# Altium project ConnectivityBoard.PrjPcb
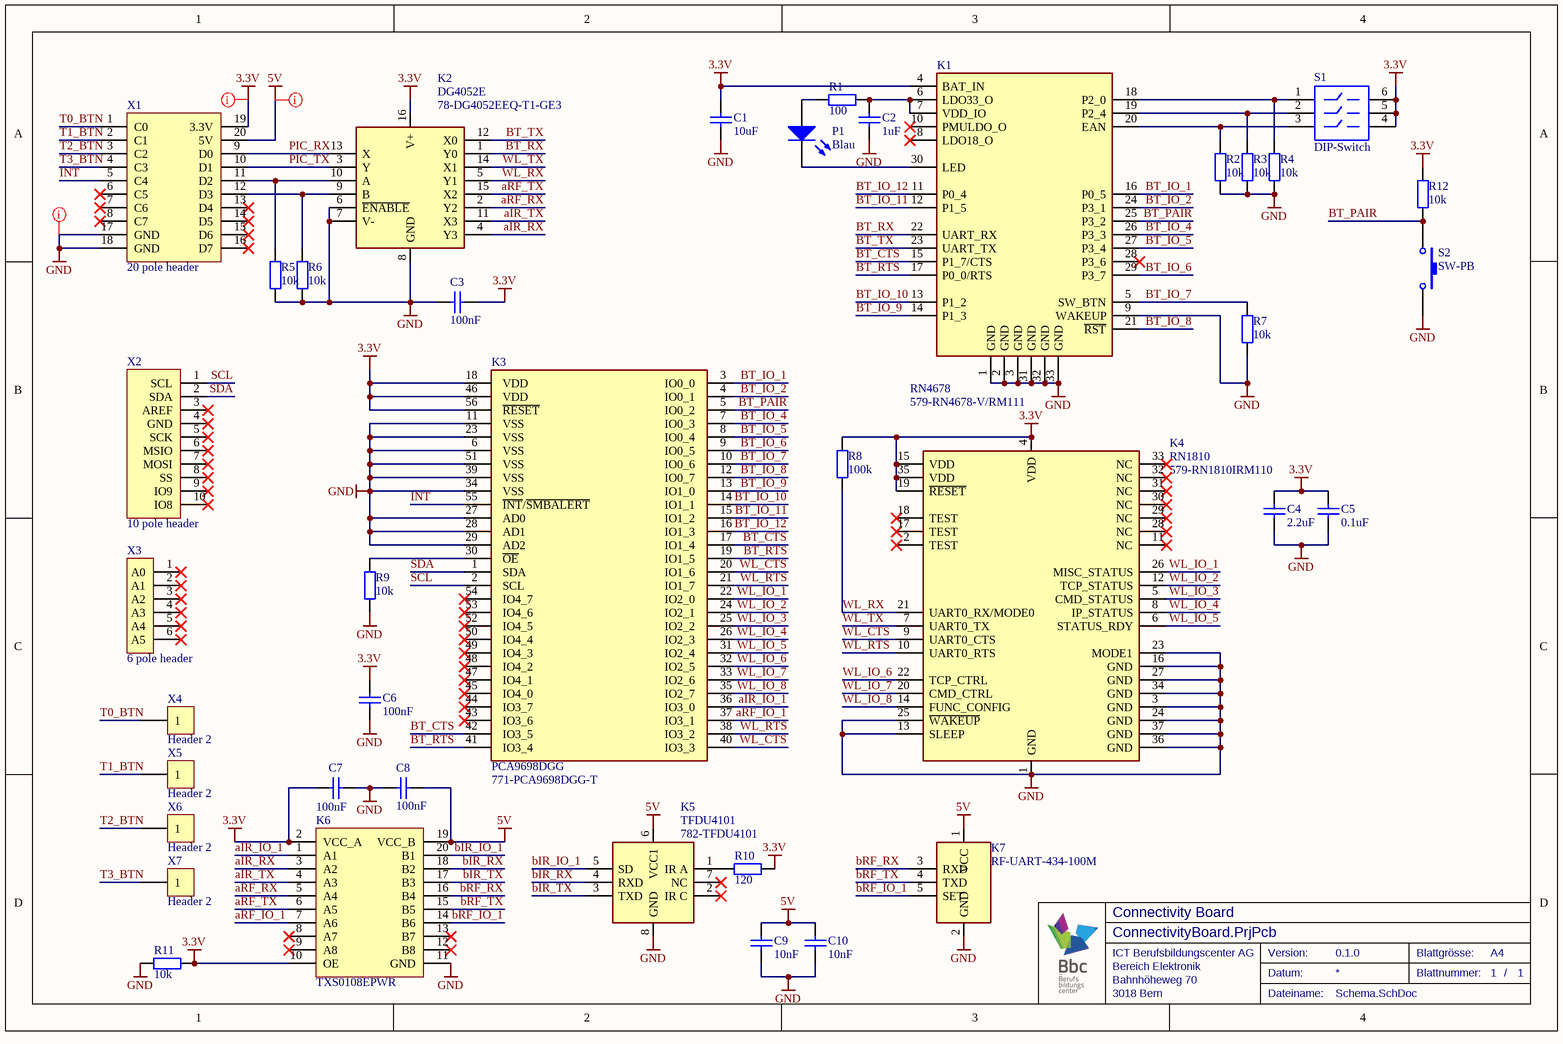
[diagram p0: Schema.SchDoc]
1 sheet, 39 parts. Net scope: global (net labels, ports and power ports of the same name join across sheets).
Board file: Leiterplatte.PcbDoc

## Sheet Schema.SchDoc: Connectivity Board
size A4; Date: 22.01.2021; Author: bweina; CompanyName: ICT Bbc AG; DrawnBy: bweina; Organization: ICT Bbc AG; DocumentNumber: 1; Revision: 0.1.0; SheetNumber: 1; SheetTotal: 1

### Parts
C1  value 10uF  [CAP CER 0805 H]  (hidden comment: Capacitor)
C2  value 1uF  [CAP CER 0805 H]  (hidden comment: Capacitor)
C3  value 100nF  [CAP CER 0805 H]  (hidden comment: Capacitor)
C4  value 2.2uF  [CAP CER 0805 H]  (hidden comment: Capacitor)
C5  value 0.1uF  [CAP CER 0805 H]  (hidden comment: Capacitor)
C6  value 100nF  [CAP CER 0805 H]  (hidden comment: Capacitor)
C7  value 100nF  [CAP CER 0805 H]  (hidden comment: Capacitor)
C8  value 100nF  [CAP CER 0805 H]  (hidden comment: Capacitor)
C9  value 10nF  [CAP CER 0805 H]  (hidden comment: Capacitor)
C10  value 10nF  [CAP CER 0805 H]  (hidden comment: Capacitor)
K1  RN4678  Supplier Part Number 1: 579-RN4678-V/RM111  [RN4678 Bluetooth Modul]
K2  DG4052E  Supplier Part Number 1: 78-DG4052EEQ-T1-GE3  [TSSOP-16]
K3  PCA9698DGG  Supplier Part Number 1: 771-PCA9698DGG-T  [TSSOP-56]
K4  RN1810  Supplier Part Number 1: 579-RN1810IRM110  [RN1810 WLAN]
K5  TFDU4101  Supplier Part Number 1: 782-TFDU4101  [TFDU4101 Infrarot Modul]
K6  TXS0108EPWR  [TSSOP-20 H]
K7  RF-UART-434-100M  [RF-UART-434-100M]
P1  Blau  [LED 1206 blue R]
R1  value 100  [RES 0805 H]  (hidden comment: Resistor)
R2  value 10k  [RES 0805 H]  (hidden comment: Resistor)
R3  value 10k  [RES 0805 H]  (hidden comment: Resistor)
R4  value 10k  [RES 0805 H]  (hidden comment: Resistor)
R5  value 10k  [RES 0805 H]  (hidden comment: Resistor)
R6  value 10k  [RES 0805 H]  (hidden comment: Resistor)
R7  value 10k  [RES 0805 H]  (hidden comment: Resistor)
R8  value 100k  [RES 0805 H]  (hidden comment: Resistor)
R9  value 10k  [RES 0805 H]  (hidden comment: Resistor)
R10  value 120  [RES 0805 H]  (hidden comment: Resistor)
R11  value 10k  [RES 0805 H]  (hidden comment: Resistor)
R12  value 10k  [RES 0805 H]  (hidden comment: Resistor)
S1  DIP-Switch  [DIP Switch SMD 3 H]
S2  SW-PB  [drucktaster]
X1  20 pole header  [Header THT male 2x10]
X2  10 pole header  [Header THT male 1x10]
X3  6 pole header  [Header THT male 1x6]
X4  Header 2  [TouchPads]
X5  Header 2  [TouchPads]
X6  Header 2  [TouchPads]
X7  Header 2  [TouchPads]

### Nets
3.3V: C1.2 C3.2 C4.2 C5.2 C6.2 C7.1 K1.4(BAT_IN) K2.16(V+) K3.18(VDD) K3.46(VDD) K3.56(~{RESET}) K4.4(VDD) K4.15(VDD) K4.19(~{RESET}) K4.35(VDD) K6.2(VCC_A) K6.10(OE) R8.2 R10.2 R11.2 R12.2 S1.4 S1.5 S1.6 X1.19(3.3V)
5V: C8.2 C9.1 C10.1 K5.6(VCC1) K6.19(VCC_B) K7.1(VCC) X1.20(5V)
GND: C1.1 C2.1 C3.1 C4.1 C5.1 C6.1 C7.2 C8.1 C9.2 C10.2 K1.1(GND) K1.2(GND) K1.3(GND) K1.9(WAKEUP) K1.31(GND) K1.32(GND) K1.33(GND) K2.6(~{ENABLE}) K2.7(V-) K2.8(GND) K3.6(VSS) K3.11(VSS) K3.23(VSS) K3.27(AD0) K3.28(AD1) K3.29(AD2) K3.34(VSS) K3.39(VSS) K3.51(VSS) K4.1(GND) K4.3(GND) K4.13(SLEEP) K4.16(GND) K4.23(MODE1) K4.24(GND) K4.25(~{WAKEUP}) K4.27(GND) K4.34(GND) K4.36(GND) K4.37(GND) K5.8(GND) K6.11(GND) K7.2(GND) R2.1 R3.1 R4.1 R5.1 R6.1 R7.1 R9.1 R11.1 S2.1 X1.17(GND) X1.18(GND)
aIR_IO_1: K3.36(IO3_0) K6.1(A1)
aIR_RX: K2.4(Y3) K6.3(A2)
aIR_TX: K2.11(X3) K6.4(A3)
aRF_IO_1: K3.37(IO3_1) K6.7(A6)
aRF_RX: K2.2(Y2) K6.5(A4)
aRF_TX: K2.15(X2) K6.6(A5)
bIR_IO_1: K5.5(SD) K6.20(B1)
bIR_RX: K5.4(RXD) K6.18(B2)
bIR_TX: K5.3(TXD) K6.17(B3)
bRF_IO_1: K6.14(B6) K7.5(SET)
bRF_RX: K6.16(B4) K7.3(RXD)
bRF_TX: K6.15(B5) K7.4(TXD)
BT_CTS: K1.15(P1_7/CTS) K3.17(IO1_4) K3.42(IO3_5)
BT_IO_1: K1.16(P0_5) K3.3(IO0_0)
BT_IO_2: K1.24(P3_1) K3.4(IO0_1)
BT_IO_4: K1.26(P3_3) K3.7(IO0_3)
BT_IO_5: K1.27(P3_4) K3.8(IO0_4)
BT_IO_6: K1.29(P3_7) K3.9(IO0_5)
BT_IO_7: K1.5(SW_BTN) K3.10(IO0_6) R7.2
BT_IO_8: K1.21(~{RST}) K3.12(IO0_7)
BT_IO_9: K1.14(P1_3) K3.13(IO1_0)
BT_IO_10: K1.13(P1_2) K3.14(IO1_1)
BT_IO_11: K1.12(P1_5) K3.15(IO1_2)
BT_IO_12: K1.11(P0_4) K3.16(IO1_3)
BT_PAIR: K1.25(P3_2) K3.5(IO0_2) R12.1 S2.4
BT_RTS: K1.17(P0_0/RTS) K3.19(IO1_5) K3.41(IO3_4)
BT_RX: K1.22(UART_RX) K2.1(Y0)
BT_TX: K1.23(UART_TX) K2.12(X0)
~{INT}: K3.55(~{INT}/~{SMBALERT}) X1.5(C4)
PIC_RX: K2.13(X) X1.9(D0)
PIC_TX: K2.3(Y) X1.10(D1)
SCL: K3.2(SCL) X2.1(SCL)
SDA: K3.1(SDA) X2.2(SDA)
T0_BTN: X1.1(C0) X4.1
T1_BTN: X1.2(C1) X5.1
T2_BTN: X1.3(C2) X6.1
T3_BTN: X1.4(C3) X7.1
WL_CTS: K3.20(IO1_6) K3.40(IO3_3) K4.9(UART0_CTS)
WL_IO_1: K3.22(IO2_0) K4.26(MISC_STATUS)
WL_IO_2: K3.24(IO2_1) K4.12(TCP_STATUS)
WL_IO_3: K3.25(IO2_2) K4.5(CMD_STATUS)
WL_IO_4: K3.26(IO2_3) K4.8(IP_STATUS)
WL_IO_5: K3.31(IO2_4) K4.6(STATUS_RDY)
WL_IO_6: K3.32(IO2_5) K4.22(TCP_CTRL)
WL_IO_7: K3.33(IO2_6) K4.20(CMD_CTRL)
WL_IO_8: K3.35(IO2_7) K4.14(FUNC_CONFIG)
WL_RTS: K3.21(IO1_7) K3.38(IO3_2) K4.10(UART0_RTS)
WL_RX: K2.5(Y1) K4.21(UART0_RX/MODE0) R8.1
WL_TX: K2.14(X1) K4.7(UART0_TX)
NetC2_2: C2.2 K1.6(LDO33_O) K1.7(VDD_IO) R1.2
NetK1_18: K1.18(P2_0) R4.2 S1.1
NetK1_19: K1.19(P2_4) R3.2 S1.2
NetK1_20: K1.20(EAN) R2.2 S1.3
NetK1_30: K1.30(LED) P1.C(Cathode)
NetK2_9: K2.9(B) R6.2 X1.12(D3)
NetK2_10: K2.10(A) R5.2 X1.11(D2)
NetK3_30: K3.30(~{OE}) R9.2
NetK5_1: K5.1(IR_A) R10.1
NetP1_A: P1.A(Anode) R1.1

Not connected (* = marked no-connect by the designer): K1 8(LDO18_O)* 10(PMULDO_O)* 28(P3_6)*; K3 43(IO3_6)* 44(IO3_7)* 45(IO4_0)* 47(IO4_1)* 48(IO4_2)* 49(IO4_3)* 50(IO4_4)* 52(IO4_5)* 53(IO4_6)* 54(IO4_7)*; K4 2(TEST)* 11(NC)* 17(TEST)* 18(TEST)* 28(NC)* 29(NC)* 30(NC)* 31(NC)* 32(NC)* 33(NC)*; K5 2(IR_C)* 7(NC)*; K6 8(A7)* 9(A8)* 12(B8)* 13(B7)*; X1 6(C5)* 7(C6)* 8(C7)* 13(D4)* 14(D5)* 15(D6)* 16(D7)*; X2 3(AREF)* 4(GND)* 5(SCK)* 6(MSIO)* 7(MOSI)* 8(SS)* 9(IO9)* 10(IO8)*; X3 1(A0)* 2(A1)* 3(A2)* 4(A3)* 5(A4)* 6(A5)*

### Layout directives
net class POWER: 3.3V, 5V, GND

### Notes on the sheet
- Bahnhöheweg 70
- ICT Berufsbildungscenter AG
- Bereich Elektronik
- Datum:
- Version:
- Blattgrösse:
- Blattnummer:
- A4
- /
- 3018 Bern
- Dateiname:

### Library data of the parts
C1-C10 = Capacitor: Non polarized capacitor; LatestRevisionDate: 01.04.2019; Publisher: ICT Berufsbildungscenter AG
K1 = Bluetooth-Modul: Bluetooth-Module (802.15.1) Bluetooth 5 Dual Mode with Shield & Antenna Module with ASCII Interface FW 1.11; ComponentLink1Description: New link; ComponentLink1URL: https://www.mouser.ch/ProductDetail/Microchip-Technology/RN4678-V-RM111/?qs=sGAEpiMZZMu3sxpa5v1qrgkV%252BmLWY283d9hxH7L%2F%2FyI%3D; Supplier 1: Mouser
K2 = AnalogSwitch: Analogschalter IC Dual 4 Ch Multiplxr Pd 450mW TSSOP-16; ComponentLink1Description: New link; ComponentLink1URL: https://www.mouser.ch/ProductDetail/Vishay-Siliconix/DG4052EEQ-T1-GE3/?qs=sGAEpiMZZMutXGli8Ay4kBLYPnxy%2FFiifqIQaprXThA%3D; Supplier 1: Mouser
K3 = PortExpander: Schnittstelle - I/O-Erweiterer 40BT I2C FM+TPGPIO IN-RS-PU OE; ComponentLink1Description: New link; ComponentLink1URL: https://www.mouser.ch/ProductDetail/NXP-Semiconductors/PCA9698DGG518/?qs=LOCUfHb8d9vt%2F8QN9%2FBdTQ%3D%3D; Supplier 1: Mouser
K4 = WLAN-Modul: WLAN-Module (802.11) On board WiFiWiFly UART and PCB antenna; ComponentLink1Description: New link; ComponentLink1URL: https://www.mouser.ch/ProductDetail/Microchip-Technology/RN1810-I-RM110/?qs=Gd3Cm49KlLOYbRKPwYAFPg%3D%3D; Supplier 1: Mouser
K5 = Infrarot-Modul: Infrarot-Transceiver SIR 115.2 kbits/s; ComponentLink1Description: New link; ComponentLink1URL: https://www.mouser.ch/ProductDetail/Vishay-Semiconductors/TFDU4101-TR3/?qs=4vzNq8kLoSZaXF7Bmpq4%252Bw%3D%3D; Supplier 1: Mouser
K6 = TXS0108EPWR: Level Shifter with internal pullups; Supplier 1: Mouser; Supplier Part Number 1: 595-TXS0108EPWR
K7 = RF-Modul: RF-Modul UART/TTL Interface 100M; ComponentLink1Description: New link; ComponentLink1URL: https://www.cytron.io/p-434mhz-rf-transceiver-module-uart-100m
P1 = LED: Light emitting diode; LatestRevisionDate: 03.04.2019; Publisher: ICT Berufsbildungscenter AG
S1 = DIP-Switch 3: Dip Switch with 3 switches; Published: 03.10.2019; LatestRevisionDate: 03.10.2019; Publisher: ICT Berufsbildungscenter AG; ComponentLink1Description: Manufacturer Link; ComponentLink1URL: http://www.oupiin.com/prodindx.html#Headers
S2 = Drucktaster: Switch, SMD; Published: 24-Mar-1999; LatestRevisionDate: 17-Jul-2002; LatestRevisionNote: Re-released for DXP Platform.; PackageReference: SPST-2; Publisher: Altium Limited; PackageDescription: Switch; 2 Leads
X1 = Header 20: board to board header; LatestRevisionDate: 02.05.2019; Publisher: ICT Berufsbildungscenter AG
X2 = Header 10: board to board header; LatestRevisionDate: 02.05.2019; Publisher: ICT Berufsbildungscenter AG
X3 = Header 6: board to board header; LatestRevisionDate: 02.05.2019; Publisher: ICT Berufsbildungscenter AG
X4-X7 = Header 1: Header, 2-Pin; LatestRevisionDate: 17-Jul-2002; LatestRevisionNote: Re-released for DXP Platform.; Publisher: Altium Limited
R1-R12 = Resistor: LatestRevisionDate: 02.04.2019; Publisher: ICT Berufsbildungscenter AG